# EAGLE design Nusbio.smd (EAGLE 7.2.0)
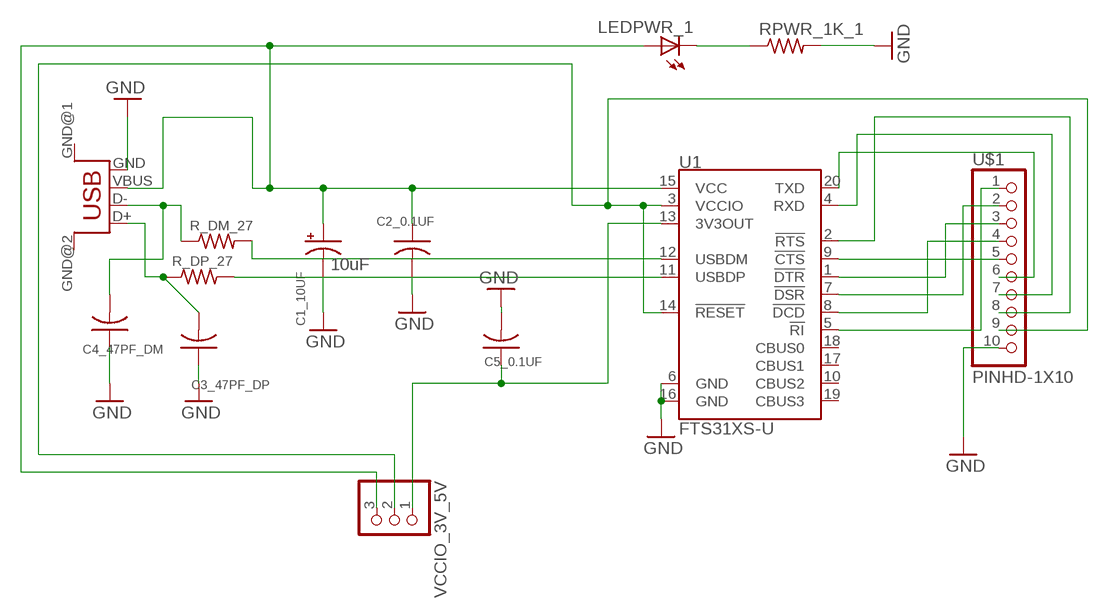
[diagram p0: schematic, sheet 1]

## Parts
C1_10UF  10uF  10UF-16V-10%(TANT)  [EIA3216]
C2_0.1UF  C-USC1206  [C1206]
C3_47PF_DP  C-USC1206  [C1206]
C4_47PF_DM  C-USC1206  [C1206]
C5_0.1UF  C-USC1206  [C1206]
LEDPWR_1  LEDCHIPLED_0805  [CHIPLED_0805]
R_DM_27  R-US_R0805  [R0805]
R_DP_27  R-US_R0805  [R0805]
RPWR_1K_1  R-US_R0805  [R0805]
U1  FTS31XS-U  FT231XS  [SSOP20_L]
U$1  PINHD-1X10  [1X10-BIG]
USB_FEMALE  USB  [USB-FEMALE-A-PTH]
VCCIO_3V_5V  PINHD-1X3  [1X03]

## Nets
GND: C1_10UF.C(-) C2_0.1UF.2 C3_47PF_DP.1 C4_47PF_DM.1 C5_0.1UF.2 RPWR_1K_1.2 U1.6(GND) U1.16(GND) U$1.10 USB_FEMALE.GND
N$1: C1_10UF.A(+) C2_0.1UF.1 LEDPWR_1.A U1.15(VCC) USB_FEMALE.VBUS VCCIO_3V_5V.3
N$2: C5_0.1UF.1 U1.13(3V3OUT) VCCIO_3V_5V.1
N$3: LEDPWR_1.C RPWR_1K_1.1
N$4: R_DM_27.2 U1.12(USBDM)
N$5: R_DP_27.2 U1.11(USBDP)
N$6: U1.20(TXD) U$1.6
N$7: U1.7(!DSR) U$1.2
N$8: U1.5(!RI) U$1.1
N$9: U1.1(!DTR) U$1.3
N$10: U1.8(!DCD) U$1.4
N$11: U1.9(!CTS) U$1.5
N$12: U1.4(RXD) U$1.7
N$13: U1.2(!RTS) U$1.8
N$14: U1.3(VCCIO) U1.14(!RESET) U$1.9 VCCIO_3V_5V.2
N$15: C3_47PF_DP.2 R_DP_27.1 USB_FEMALE.D+
N$16: C4_47PF_DM.2 R_DM_27.1 USB_FEMALE.D-
Unconnected: U1.10(CBUS2) U1.17(CBUS1) U1.18(CBUS0) U1.19(CBUS3) USB_FEMALE.GND@1(GND) USB_FEMALE.GND@2(GND)

## Library data of the parts
C1_10UF = SparkFun-Capacitors:10UF-16V-10%(TANT): CAP-00811 1206/EIA-3216 Tantalum capacitor; PROD_ID: CAP-00811
C2_0.1UF C3_47PF_DP C4_47PF_DM C5_0.1UF = adafruit:C-US: CAPACITOR, American symbol
LEDPWR_1 = adafruit:LED: LED OSRAM: - CHIPLED LG R971, LG N971, LY N971, LG Q971, LY Q971, LO R971, LY R971 LH N974, LH R974 LS Q976, LO Q976, LY Q976 LO Q996 - Hyper CHIPLED LW Q18S LB Q993, LB Q99A, LB R99A - SideLED LS A670, LO A670, LY A670, LG A670, LP A670 LB A673, LV A673, LT A673, LW A673 LH A674 LY A675 LS A676, LA A676, LO A676, LY A676, LW A676 LS A679, LY A679, LG A679 - Hyper Micro SIDELED® LS Y876, LA Y876, LO Y876, LY Y876 LT Y87S - SmartLED LW L88C, LW L88S LB L89C, LB L89S, LG L890 LS L89K, LO L89K, LY L89K LS L896, LA L896, LO L896, LY L896 - TOPLED LS T670, LO T670, LY T670, LG T670, LP T670 LSG T670, LSP T670, LSY T670, LOP T670, LYG T670 LG T671, LOG T671, LSG T671 LB T673, LV T673, LT T673, LW T673 LH T674 LS T676, LA T676, LO T676, LY T676, LB T676, LH T676, LSB T676, LW T676 LB T67C, LV T67C, LT T67C, LS T67K, LO T67K, LY T67K, LW E67C LS E67B, LA E67B, LO E67B, LY E67B, LB E67C, LV E67C, LT E67C LW T67C LS T679, LY T679, LG T679 LS T770, LO T770, LY T770, LG T770, LP T770 LB T773, LV T773, LT T773, LW T773 LH T774 LS E675, LA E675, LY E675, LS T675 LS T776, LA T776, LO T776, LY T776, LB T776 LHGB T686 LT T68C, LB T68C - Hyper Mini TOPLED® LB M676 - Mini TOPLED Santana® LG M470 LS M47K, LO M47K, LY M47K Source: http://www.osram.convergy.de/
R_DM_27 R_DP_27 RPWR_1K_1 = adafruit:R-US_: RESISTOR, American symbol
U1 = SparkFun-DigitalIC:FT231X: FTDI FT231X Full Speed USB to Full-handshake UART This USB2.0 Full Speed IC offers a compact bridge to full handshake UART interfaces. The device is a UART, capable of operating up to 3MBaud, with low power consumption (8mA). The FT231X includes the complete FT-X series feature set and enables USB to be added into a system design quickly and easily over a UART interface.; PROD_ID: IC-11524
U$1 = adafruit:PINHD-1X10: Pin header 1x10 0.1" spacing With round pins
USB_FEMALE = STUNTAZ:USB: USB Connectors USB-FEMALE-A-PTH: Through hole Female Type A Connector
VCCIO_3V_5V = adafruit:PINHD-1X3: PIN HEADER

## Board
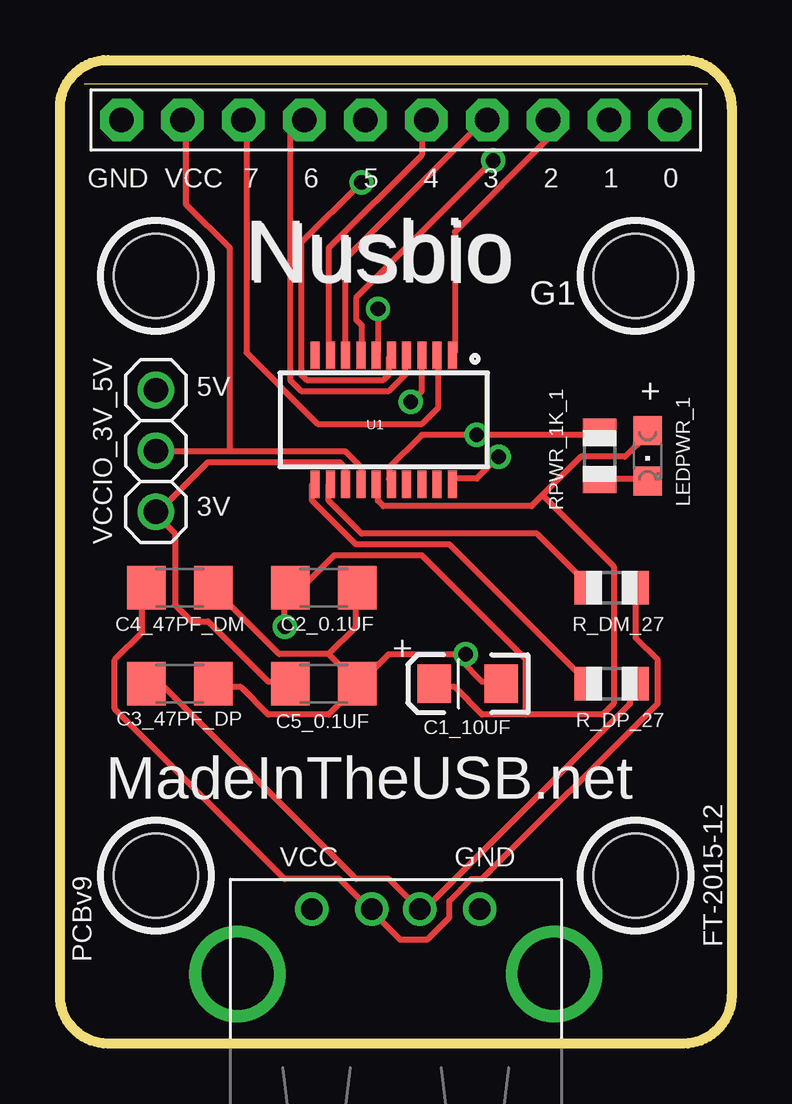
[diagram p1: board, top side]
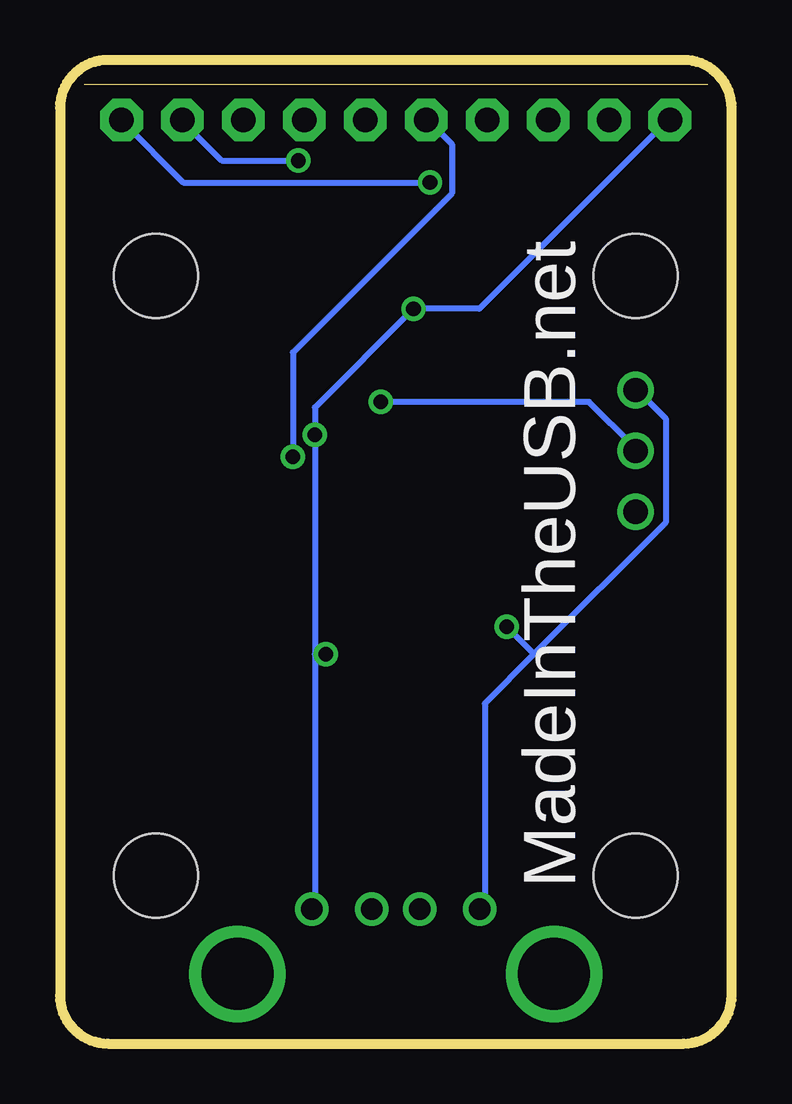
[diagram p2: board, bottom side, seen from below]

Size 28 x 41 mm. Coordinates in mm from the lower left corner, seen from the top.
Outline: 27,40 1,40
Outline: 2,0 arc-90 0,2 0,39 arc-90 2,41 26,41 arc-90 28,39 28,2 arc-90 26,0 2,0
Copper layers (1*16): Top 0.035mm / dielectric 1.5mm / Bottom 0.035mm
Design rules "default": minimum track width 10mil, minimum drill 24mil, track to track 8mil, track to pad 8mil, pad to pad 8mil, via to via 8mil, smd to smd 8mil, copper to edge 40mil, drill to drill 8mil, minimum pad ring 10mil, minimum via ring 8mil, stop-mask expansion 4mil, vias tented up to drill 0mil, thermal gap 10mil
Holes 3.5 mm at 4,7 24,7 24,32 4,32

### Footprints (pad centres in the part's own frame; a part is rotated, then mirrored left to right if it is on the bottom)
EIA3216 = smd 1.4 x 1.6: A 1.4,0; C -1.4,0
C1206 = smd 1.6 x 1.8: 1 -1.4,0; 2 1.4,0
CHIPLED_0805 = smd 1.2 x 1.2: A 0,-1.05; C 0,1.05
R0805 = smd 1.1 x 1.4: 1 -1,0; 2 1,0
SSOP20_L = smd 0.381 x 1.143: 1 -2.857,-2.68; 2 -2.223,-2.68; 3 -1.587,-2.68; 4 -0.953,-2.68; 5 -0.318,-2.68; 6 0.318,-2.68; 7 0.953,-2.68; 8 1.587,-2.68; 9 2.223,-2.68; 10 2.857,-2.68; 11 2.857,2.68; 12 2.223,2.68; 13 1.587,2.68; 14 0.953,2.68; 15 0.318,2.68; 16 -0.318,2.68; 17 -0.953,2.68; 18 -1.587,2.68; 19 -2.223,2.68; 20 -2.857,2.68
1X10-BIG = drill 1.016 pad 1.778 octagon: 1 -11.43,0; 2 -8.89,0; 3 -6.35,0; 4 -3.81,0; 5 -1.27,0; 6 1.27,0; 7 3.81,0; 8 6.35,0; 9 8.89,0; 10 11.43,0
USB-FEMALE-A-PTH = drill 0.9: D+ 5.9,1.3; D- 7.9,1.3; GND 3.4,1.3; VBUS 10.4,1.3 | drill 3: GND@1 13.5,4; GND@2 0.3,4
1X03 = drill 1.016: 1 -2.54,0; 2 0,0; 3 2.54,0

### Placement (x,y rotation side)
C1_10UF  17,15 180 top
C2_0.1UF  11,19 0 top
C3_47PF_DP  5,15 180 top
C4_47PF_DM  5,19 180 top
C5_0.1UF  11,15 0 top
LEDPWR_1  24.5,24.5 180 top
R_DM_27  23,19 180 top
R_DP_27  23,15 180 top
RPWR_1K_1  22.5,24.5 90 top
U1  13.5,26 180 top
U$1  14,38.5 180 top
USB_FEMALE  20.9,6.9 180 top
VCCIO_3V_5V  4,24.7 90 top

### Tracks (layer width: path | path; a pad name or v marks a point on that pad's centre or on a via)
GND  (via drill 0.61)
  Top 0.254: 16.69,16 16.46,16.23 13.72,16.23 12.57,15.09 C5_0.1UF.2 | 16.69,16 17.6,15.09 18.29,15.09 C1_10UF.C | C3_47PF_DP.1 6.4,14.86 7.54,14.86 8.69,13.72 11.2,13.72 12.34,14.86 C5_0.1UF.2 | 11.2,16.23 9.14,16.23 6.4,18.97 C4_47PF_DM.1 | 11.2,16.23 12.34,15.09 C5_0.1UF.2 | 11.2,16.23 12.34,17.37 12.34,18.97 C2_0.1UF.2 | U1.16 13.72,23.55 13.72,24 15.09,25.38 v17.37,25.38 22.4,25.38 RPWR_1K_1.2 | v13.26,30.63 13.26,28.8 U1.6 | v16.92,16.23 16.69,16
  Bottom 0.254: U$1.10 2.74,38.41 10.52,30.63 v13.26,30.63 17.37,26.52 v17.37,25.38 17.37,16.23 | 17.37,16.23 17.37,5.71 USB_FEMALE.GND | 17.37,16.23 v16.92,16.23
N$1  (via drill 0.61)
  Top 0.254: 20.12,22.86 21.72,24.46 23.55,24.46 24.46,25.38 LEDPWR_1.A | 20.12,22.86 19.66,22.4 13.49,22.4 13.26,22.63 13.26,23.32 U1.15 | 19.43,13.72 22.63,13.72 23.09,14.17 23.09,19.89 20.12,22.86 | 19.43,13.72 17.6,13.72 16.46,14.86 15.77,14.86 C1_10UF.A | 19.43,13.72 19.43,16 15.09,20.34 11.43,20.34 10.29,19.2 9.6,19.2 C2_0.1UF.1 9.37,18.97 v9.37,17.37
  Bottom 0.254: 8.23,16.23 2.74,21.72 2.74,26.06 3.89,27.2 VCCIO_3V_5V.3 | 8.23,16.23 10.29,14.17 10.29,5.71 USB_FEMALE.VBUS | 8.23,16.23 v9.37,17.37
N$2
  Top 0.254: U1.13 11.89,23.55 11.89,24 11.66,24.23 6.17,24.23 4.12,22.17 VCCIO_3V_5V.1 4.12,21.95 4.8,21.26 4.8,18.29 5.49,17.6 6.17,17.6 8.69,15.09 9.37,15.09 C5_0.1UF.1
N$3
  Top 0.254: LEDPWR_1.C 24.46,23.55 22.63,23.55 RPWR_1K_1.1
N$4
  Top 0.254: U1.12 11.2,23.32 11.2,22.63 12.57,21.26 19.89,21.26 21.95,19.2 R_DM_27.2
N$5
  Top 0.254: U1.11 10.52,23.32 10.52,22.63 12.34,20.8 16.23,20.8 21.95,15.09 R_DP_27.2
N$6  (via drill 0.61)
  Top 0.254: v18.29,24.46 17.37,23.55 16.46,23.55 U1.20
  Bottom 0.254: v18.29,24.46 18.29,28.8 11.66,35.43 11.66,37.49 12.57,38.41 U$1.6
N$7  (via drill 0.61)
  Top 0.254: v18.06,36.8 12.34,31.09 12.34,30.18 12.57,29.95 12.57,28.8 U1.7
  Bottom 0.254: v18.06,36.8 21.26,36.8 22.86,38.41 U$1.2
N$8  (via drill 0.61)
  Top 0.254: v12.57,35.89 10.06,33.38 10.06,27.89 10.29,27.66 13.49,27.66 13.72,27.89 13.72,28.57 U1.5
  Bottom 0.254: v12.57,35.89 22.86,35.89 25.38,38.41 U$1.1
N$9
  Top 0.254: U1.1 16.46,28.8 16.46,33.83 20.34,37.72 20.34,38.41 U$1.3
N$10
  Top 0.254: U1.8 11.89,28.8 11.89,32.69 17.6,38.41 U$1.4
N$11
  Top 0.254: U1.9 11.2,28.8 11.2,33.15 15.09,37.03 15.09,38.41 U$1.5
N$12
  Top 0.254: U1.4 14.4,28.57 14.4,27.89 13.72,27.2 10.06,27.2 9.6,27.66 9.6,37.95 10.06,38.41 U$1.7
N$13
  Top 0.254: U1.2 15.77,28.57 15.77,26.52 15.09,25.83 10.74,25.83 7.77,28.8 7.77,38.41 U$1.8
N$14  (via drill 0.61)
  Top 0.254: 7.09,24.69 4.12,24.69 VCCIO_3V_5V.2 | 7.09,24.69 11.89,24.69 12.57,24 12.57,23.55 U1.14 | v14.63,26.75 15.09,27.2 15.09,28.57 U1.3 | 7.09,24.69 7.09,33.15 5.26,34.98 5.26,38.41 U$1.9
  Bottom 0.254: v14.63,26.75 5.94,26.75 4.12,24.92 VCCIO_3V_5V.2
N$15
  Top 0.254: R_DP_27.1 23.77,14.86 23.77,14.17 15.09,5.49 USB_FEMALE.D+ 14.86,5.71 13.72,6.86 12.34,6.86 4.34,14.86 3.66,14.86 C3_47PF_DP.2
N$16
  Top 0.254: R_DM_27.1 24,18.97 24,16.92 24.92,16 24.92,14.17 17.6,6.86 17.14,6.86 16.23,5.94 16.23,5.26 15.32,4.34 14.17,4.34 13.03,5.49 USB_FEMALE.D- 12.8,5.71 11.66,6.86 9.37,6.86 2.29,13.95 2.29,16 3.43,17.14 3.43,18.97 C4_47PF_DM.2

### Text on the board
tNames: GND | VCC | 7 | 6 | 5 | 4 | 3 | 2 | 1 | 0 | Nusbio | Nusbio | G1 | 5V | + | 3V | + | MadeInTheUSB.net | FT-2015-12 | VCC | GND | PCBv9
bNames: MadeInTheUSB.net